# Altium schematic sheet Power.SchDoc
size A4
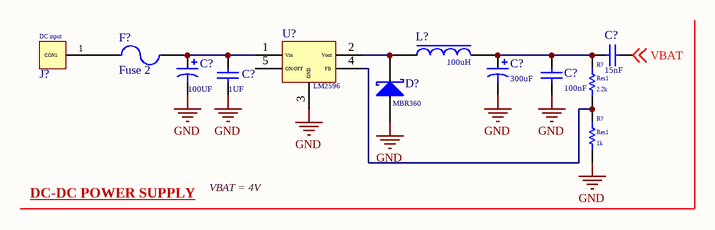
[diagram p0: Power.SchDoc]

## Parts
(Parts that share a designator on the sheet are numbered #1, #2 ... from top to bottom, then left to right.)
C?#1  value 15nF  [RAD-0.3]  (hidden comment: Cap)
C?#2  value 100UF  [RB7.6-15]
C?#3  value 300uF  [RB7.6-15]  (hidden comment: Cap Pol1)
C?#4  value 1UF  [RAD-0.3]  (hidden comment: Cap)
C?#5  value 100nF  [RAD-0.3]  (hidden comment: Cap)
D?  MBR360  [SMB]
F?  Fuse 2  [PIN-W2/E2.8]
J?  DC input
L?  value 100uH  (hidden comment: L101)
R?#1  Res1  value 2.2k  [AXIAL-0.3]
R?#2  Res1  value 1k  [AXIAL-0.3]
U?  LM2596

## Nets
GND: C?#2.2 C?#3.2 C?#4.1 C?#5.1 D?.1(A) R?#2.1 U?.3(GND)
VBAT: C?#1.2 ; off-sheet VBAT
NetC?#1_1: C?#1.1 C?#3.1 C?#5.2 L?.2 R?#1.2
NetC?#2_1: C?#2.1 C?#4.2 F?.2 U?.1(Vin)
NetD?_2: D?.2(K) L?.1 U?.2(Vout)
NetF?_1: F?.1 J?.1(CON1)
NetR?#1_1: R?#1.1 R?#2.2 U?.4(FB)

Not connected (* = marked no-connect by the designer): U? 5(ON/OFF)

## Notes on the sheet
- DC-DC POWER SUPPLY
- VBAT = 4V

## Library data of the parts
C?#1 C?#4 C?#5 = Cap: Capacitor; Published: 8-Jun-2000; LatestRevisionDate: 17-Jul-2002; LatestRevisionNote: Re-released for DXP Platform.; PackageReference: RAD-0.3; Publisher: Altium Limited; PackageDescription: Radial Cap, Thru-Hole; 2 Leads; 0.3 in Pin Spacing
C?#2 C?#3 = Cap Pol1: Polarized Capacitor (Radial); Published: 8-Jun-2000; LatestRevisionDate: 17-Jul-2002; LatestRevisionNote: Re-released for DXP Platform.; PackageReference: RB7.6-15; Publisher: Altium Limited; PackageDescription: Polarized Capacitor (Radial); 2 Leads
D? = D Schottky: Schottky Diode; Published: 8-Jun-2000; LatestRevisionDate: 17-Jul-2002; LatestRevisionNote: Re-released for DXP Platform.; PackageReference: SMB; Publisher: Altium Limited; PackageDescription: DO-214-AA/SMB; 2 C-Bend Leads; Body 5.3 x 3.6 mm, inc. leads (LxW); Code_JEDEC: DO-214-AA
F? = Fuse 2: Fuse; Published: 8-Jun-2000; LatestRevisionDate: 17-Jul-2002; LatestRevisionNote: Re-released for DXP Platform.; PackageReference: PIN-W2/E2.8; Publisher: Altium Limited; PackageDescription: Thru-Hole; 2 Leads
J? = Header 1
R?#1 R?#2 = Res1: Resistor; Published: 8-Jun-2000; LatestRevisionDate: 17-Jul-2002; LatestRevisionNote: Re-released for DXP Platform.; PackageReference: AXIAL-0.3; Publisher: Altium Limited; PackageDescription: Axial Device, Thru-Hole; 2 Leads; 0.3 in Pin Spacing